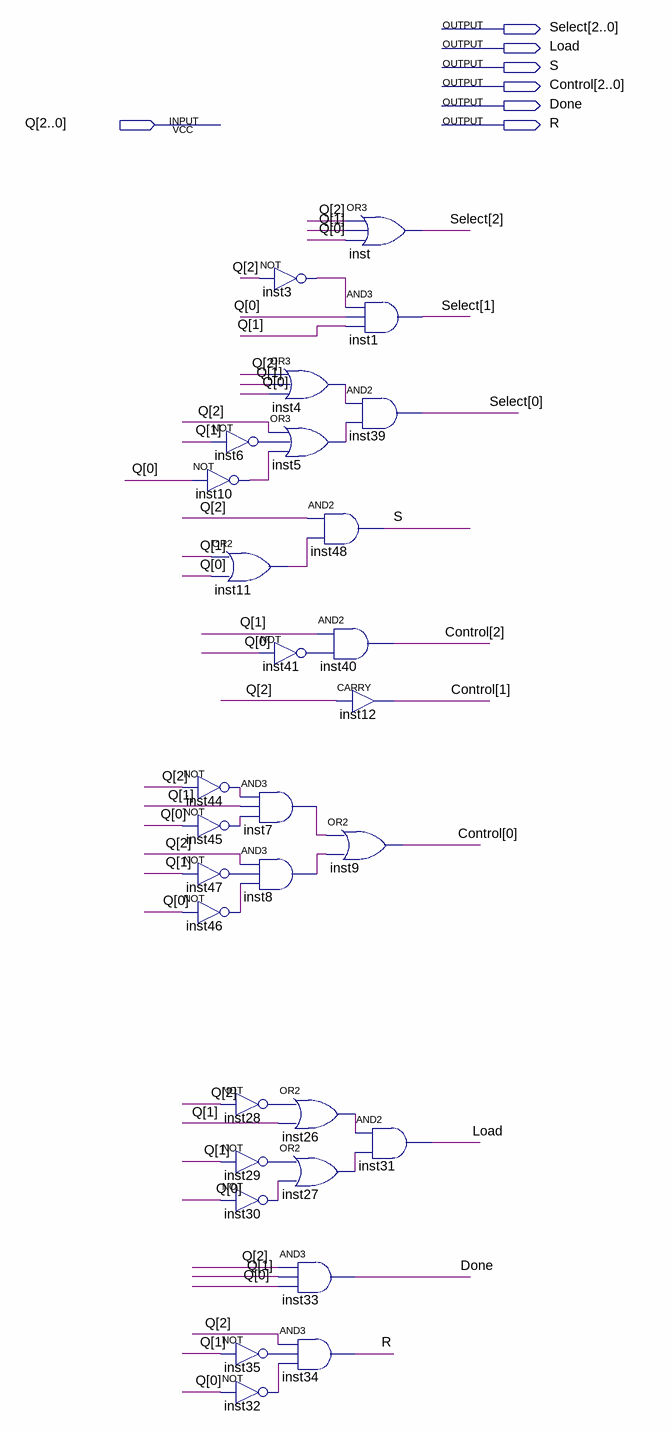
[diagram p0: schematic sheet]
// Quartus schematic Output_logic_version3.bdf as structural Verilog: 30 symbols, 7 pins
module Output_logic_version3 (
  input  [2:0] Q,
  output [2:0] Select,
  output Load,
  output S,
  output [2:0] Control,
  output Done,
  output R
);

  wire inst3_out, inst4_out, inst5_out, inst6_out, inst7_out, inst8_out, inst10_out, inst11_out, inst26_out,
       inst27_out, inst28_out, inst29_out, inst30_out, inst32_out, inst35_out, inst41_out, inst44_out,
       inst45_out, inst46_out, inst47_out;

  not inst6 (inst6_out, Q[1]);
  not inst10 (inst10_out, Q[0]);
  or inst11 (inst11_out, Q[1], Q[0]);
  not inst44 (inst44_out, Q[2]);
  and inst7 (inst7_out, inst44_out, Q[1], inst45_out);
  not inst45 (inst45_out, Q[0]);
  and inst8 (inst8_out, Q[2], inst47_out, inst46_out);
  not inst47 (inst47_out, Q[1]);
  not inst46 (inst46_out, Q[0]);
  not inst28 (inst28_out, Q[2]);
  not inst29 (inst29_out, Q[1]);
  not inst30 (inst30_out, Q[0]);
  not inst35 (inst35_out, Q[1]);
  not inst32 (inst32_out, Q[0]);
  not inst3 (inst3_out, Q[2]);
  or inst4 (inst4_out, Q[2], Q[1], Q[0]);
  or inst5 (inst5_out, Q[2], inst6_out, inst10_out);
  and inst48 (S, Q[2], inst11_out);
  and inst40 (Control[2], Q[1], inst41_out);
  not inst41 (inst41_out, Q[0]);
  or inst26 (inst26_out, inst28_out, Q[1]);
  or inst27 (inst27_out, inst29_out, inst30_out);
  and inst33 (Done, Q[2], Q[1], Q[0]);
  and inst34 (R, Q[2], inst35_out, inst32_out);
  or inst (Select[2], Q[2], Q[1], Q[0]);
  and inst1 (Select[1], inst3_out, Q[0], Q[1]);
  and inst39 (Select[0], inst4_out, inst5_out);
  CARRY inst12 (.IN(Q[2]), .OUT(Control[1]));
  or inst9 (Control[0], inst7_out, inst8_out);
  and inst31 (Load, inst26_out, inst27_out);
endmodule
